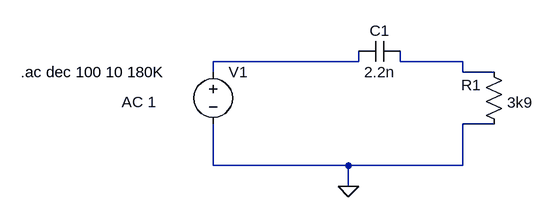
[diagram p0: schematic Ejercicio 1 - Pasaalto.asc]
Ejercicio 1 - Pasaalto.asc, the LTspice schematic file:
Version 4
SHEET 1 880 680
WIRE 144 112 144 96
WIRE 144 112 -80 112
WIRE 208 112 208 96
WIRE 304 112 208 112
WIRE -80 128 -80 112
WIRE 304 128 304 112
WIRE 352 128 304 128
WIRE 352 208 304 208
WIRE -80 272 -80 208
WIRE 128 272 -80 272
WIRE 304 272 304 208
WIRE 304 272 128 272
WIRE 128 304 128 272
FLAG 128 304 0
SYMBOL res 368 224 R180
WINDOW 0 36 76 Left 2
WINDOW 3 -43 49 Left 2
SYMATTR InstName R1
SYMATTR Value 3k9
SYMBOL cap 208 80 R90
WINDOW 0 0 32 VBottom 2
WINDOW 3 32 32 VTop 2
SYMATTR InstName C1
SYMATTR Value 2.2n
SYMBOL voltage -80 112 R0
WINDOW 123 -141 62 Left 2
WINDOW 39 0 0 Left 0
SYMATTR Value2 AC 1
SYMATTR InstName V1
SYMATTR Value ""
TEXT -376 128 Left 2 !.ac dec 100 10 180K

The netlist it stands for:
* Ejercicio 1 - Pasaalto.asc
R1 0 N002 3k9
C1 N002 N001 2.2n
V1 N001 0 AC 1
.ac dec 100 10 180K
.backanno
.end